# Altium project 电机驱动L298N带光耦.PrjPCB
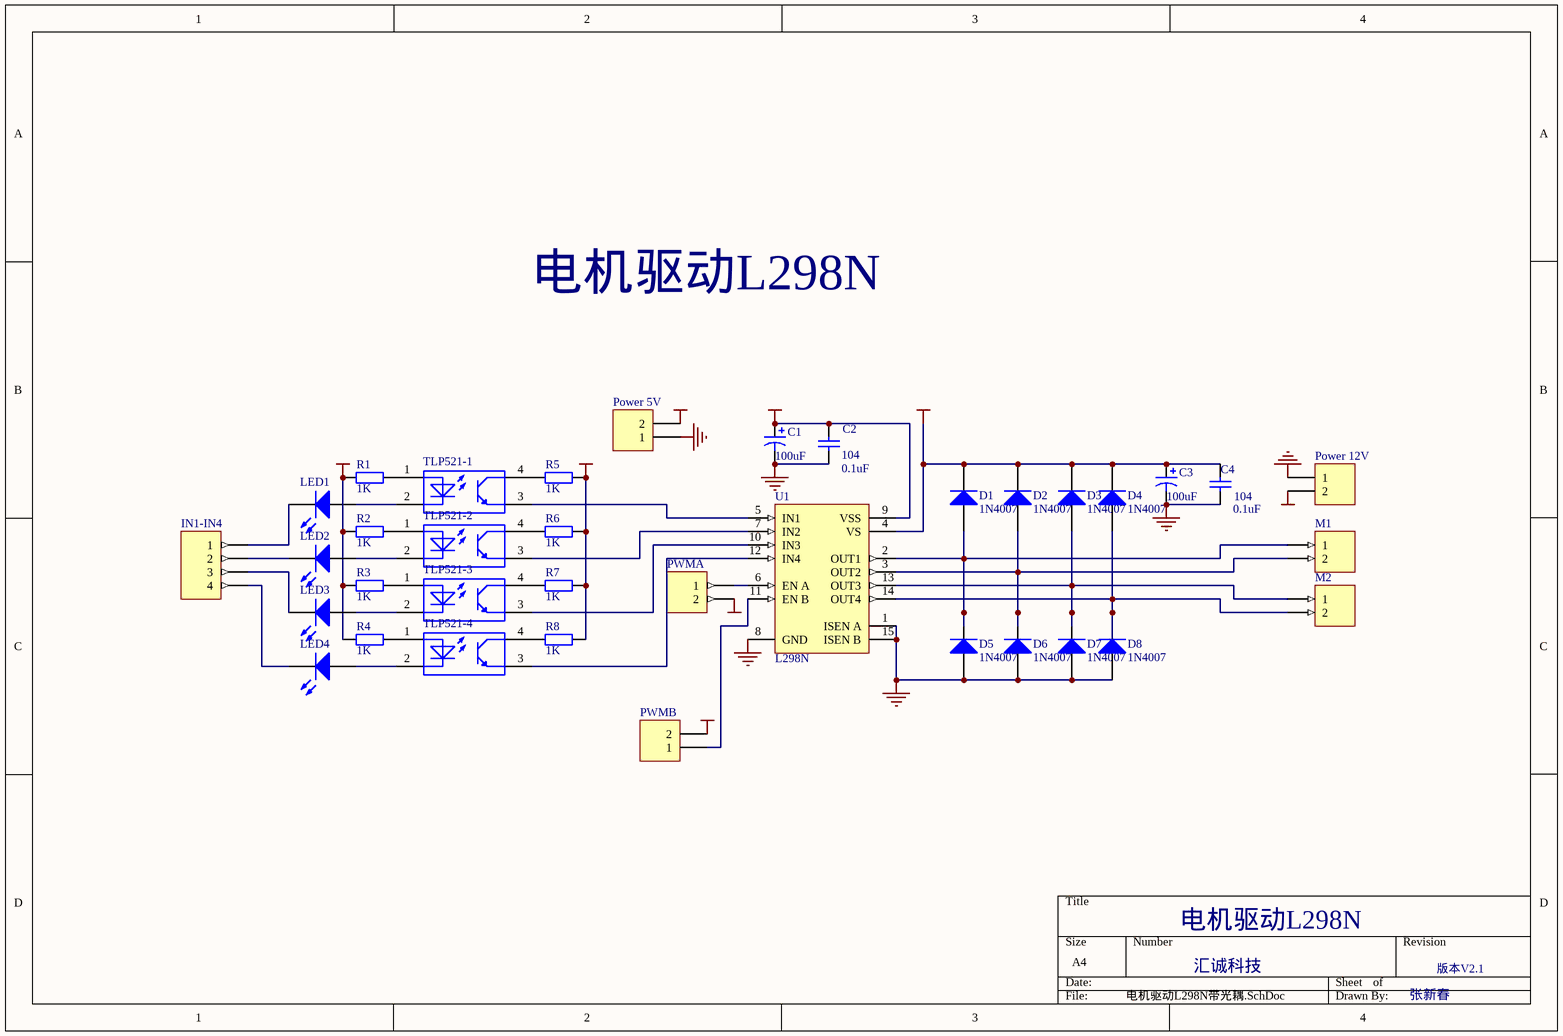
[diagram p0: 电机驱动L298N带光耦.SchDoc]
1 sheet, 36 parts. Net scope: global (net labels, ports and power ports of the same name join across sheets).
Board file: 电机驱动L298N带光耦.PcbDoc

## Sheet 电机驱动L298N带光耦.SchDoc
size A4

### Parts
C1  value 100uF  [CAPPR2-5x6.8]
C2  104  value 0.1uF  [BAT-2]
C3  value 100uF  [CAPPR2-5x6.8]
C4  104  value 0.1uF  [BAT-2]
D1  1N4007  [DIO10.46-5.3x2.8]
D2  1N4007  [DIO10.46-5.3x2.8]
D3  1N4007  [DIO10.46-5.3x2.8]
D4  1N4007  [DIO10.46-5.3x2.8]
D5  1N4007  [DIO10.46-5.3x2.8]
D6  1N4007  [DIO10.46-5.3x2.8]
D7  1N4007  [DIO10.46-5.3x2.8]
D8  1N4007  [DIO10.46-5.3x2.8]
IN1-IN4  (no value)  [HDR1X4]
LED1  (no value)  [HDR1X2]
LED2  (no value)  [HDR1X2]
LED3  (no value)  [HDR1X2]
LED4  (no value)  [HDR1X2]
M1  (no value)  [PCBComponent_1]
M2  (no value)  [PCBComponent_1]
Power_5V  (no value)  [HDR1X2]
Power_12V  (no value)  [PCBComponent_1]
PWMA  (no value)  [HDR1X2]
PWMB  (no value)  [HDR1X2]
R1  value 1K  [HDR1X2]
R2  value 1K  [HDR1X2]
R3  value 1K  [HDR1X2]
R4  value 1K  [HDR1X2]
R5  value 1K  [HDR1X2]
R6  value 1K  [HDR1X2]
R7  value 1K  [HDR1X2]
R8  value 1K  [HDR1X2]
TLP521-1  (no value)  [DIP4]
TLP521-2  (no value)  [DIP4]
TLP521-3  (no value)  [DIP4]
TLP521-4  (no value)  [DIP4]
U1  L298N  [DFM-T15/X1.6V]

### Nets
+5V: C1.1 C2.2 Power_5V.2 PWMA.2 PWMB.2 R1.1 R2.1 R3.1 R4.1 R5.2 R6.2 R7.2 R8.2 U1.9(VSS)
+12V: C3.1 C4.2 D1.2(K) D2.2(K) D3.2(K) D4.2(K) Power_12V.2 U1.4(VS)
GND: C1.2 C2.1 C3.2 C4.1 D5.1(A) D6.1(A) D7.1(A) D8.1(A) Power_5V.1 Power_12V.1 U1.1(ISEN_A) U1.8(GND) U1.15(ISEN_B)
NetD1_1: D1.1(A) D5.2(K) M1.1 U1.2(OUT1)
NetD2_1: D2.1(A) D6.2(K) M1.2 U1.3(OUT2)
NetD3_1: D3.1(A) D7.2(K) M2.1 U1.13(OUT3)
NetD4_1: D4.1(A) D8.2(K) M2.2 U1.14(OUT4)
NetIN1-IN4_1: IN1-IN4.1 LED1.2(K)
NetIN1-IN4_2: IN1-IN4.2 LED2.2(K)
NetIN1-IN4_3: IN1-IN4.3 LED3.2(K)
NetIN1-IN4_4: IN1-IN4.4 LED4.2(K)
NetLED1_1: LED1.1(A) TLP521-1.2
NetLED2_1: LED2.1(A) TLP521-2.2
NetLED3_1: LED3.1(A) TLP521-3.2
NetLED4_1: LED4.1(A) TLP521-4.2
NetPWMA_1: PWMA.1 U1.6(EN_A)
NetPWMB_1: PWMB.1 U1.11(EN_B)
NetR1_2: R1.2 TLP521-1.1
NetR2_2: R2.2 TLP521-2.1
NetR3_2: R3.2 TLP521-3.1
NetR4_2: R4.2 TLP521-4.1
NetR5_1: R5.1 TLP521-1.4
NetR6_1: R6.1 TLP521-2.4
NetR7_1: R7.1 TLP521-3.4
NetR8_1: R8.1 TLP521-4.4
NetTLP521-1_3: TLP521-1.3 U1.5(IN1)
NetTLP521-2_3: TLP521-2.3 U1.7(IN2)
NetTLP521-3_3: TLP521-3.3 U1.10(IN3)
NetTLP521-4_3: TLP521-4.3 U1.12(IN4)

### Notes on the sheet
- 电机驱动L298N
- 汇诚科技
- 版本V2.1
- 张新春

### Library data of the parts
C1 C3 = Cap Pol3: Polarized Capacitor (Surface Mount); Published: 8-Jun-2000; LatestRevisionDate: 17-Jul-2002; LatestRevisionNote: Re-released for DXP Platform.; PackageReference: C0805; Publisher: Altium Limited
C2 C4 = Cap: Capacitor; Published: 8-Jun-2000; LatestRevisionDate: 17-Jul-2002; LatestRevisionNote: Re-released for DXP Platform.; Publisher: Altium Limited
D1-D8 = Diode 1N4007: 1 Amp General Purpose Rectifier; Published: 8-Jun-2000; LatestRevisionDate: 17-Jul-2002; LatestRevisionNote: Re-released for DXP Platform.; DatasheetDocument: 1998; PackageDocument: Aug-1999; PackageReference: DO-41; Publisher: Altium Limited; Code_JEDEC: DO-204-AL
IN1-IN4 = MHDR1X4: Header, 4-Pin; LatestRevisionDate: 17-Jul-2002; LatestRevisionNote: Re-released for DXP Platform.; Publisher: Altium Limited
LED1-LED4 = LED3: Typical BLUE SiC LED; Published: 8-Jun-2000; LatestRevisionDate: 17-Dec-2003; LatestRevisionNote: PCB Footprint replaced.; Publisher: Altium Limited
M1 M2 Power_5V Power_12V PWMA PWMB = MHDR1X2: Header, 2-Pin; LatestRevisionDate: 17-Jul-2002; LatestRevisionNote: Re-released for DXP Platform.; Publisher: Altium Limited
R1-R8 = Res2: Resistor; Published: 8-Jun-2000; LatestRevisionDate: 17-Jul-2002; LatestRevisionNote: Re-released for DXP Platform.; Publisher: Altium Limited
TLP521-1-TLP521-4 = TLP521-1
U1 = L298N: Dual Full Bridge Driver; Published: 8-Jun-2000; LatestRevisionDate: 17-Jul-2002; LatestRevisionNote: Re-released for DXP Platform.; DatasheetDocument: Jul-1999; PackageDocument: Apr-1998; PackageReference: Multiwatt15H; Publisher: Altium Limited; ComponentLink1Description: Manufacturer Link; ComponentLink1URL: http://www.st.com/